# EAGLE design APRS_DP (EAGLE 9.2.2)
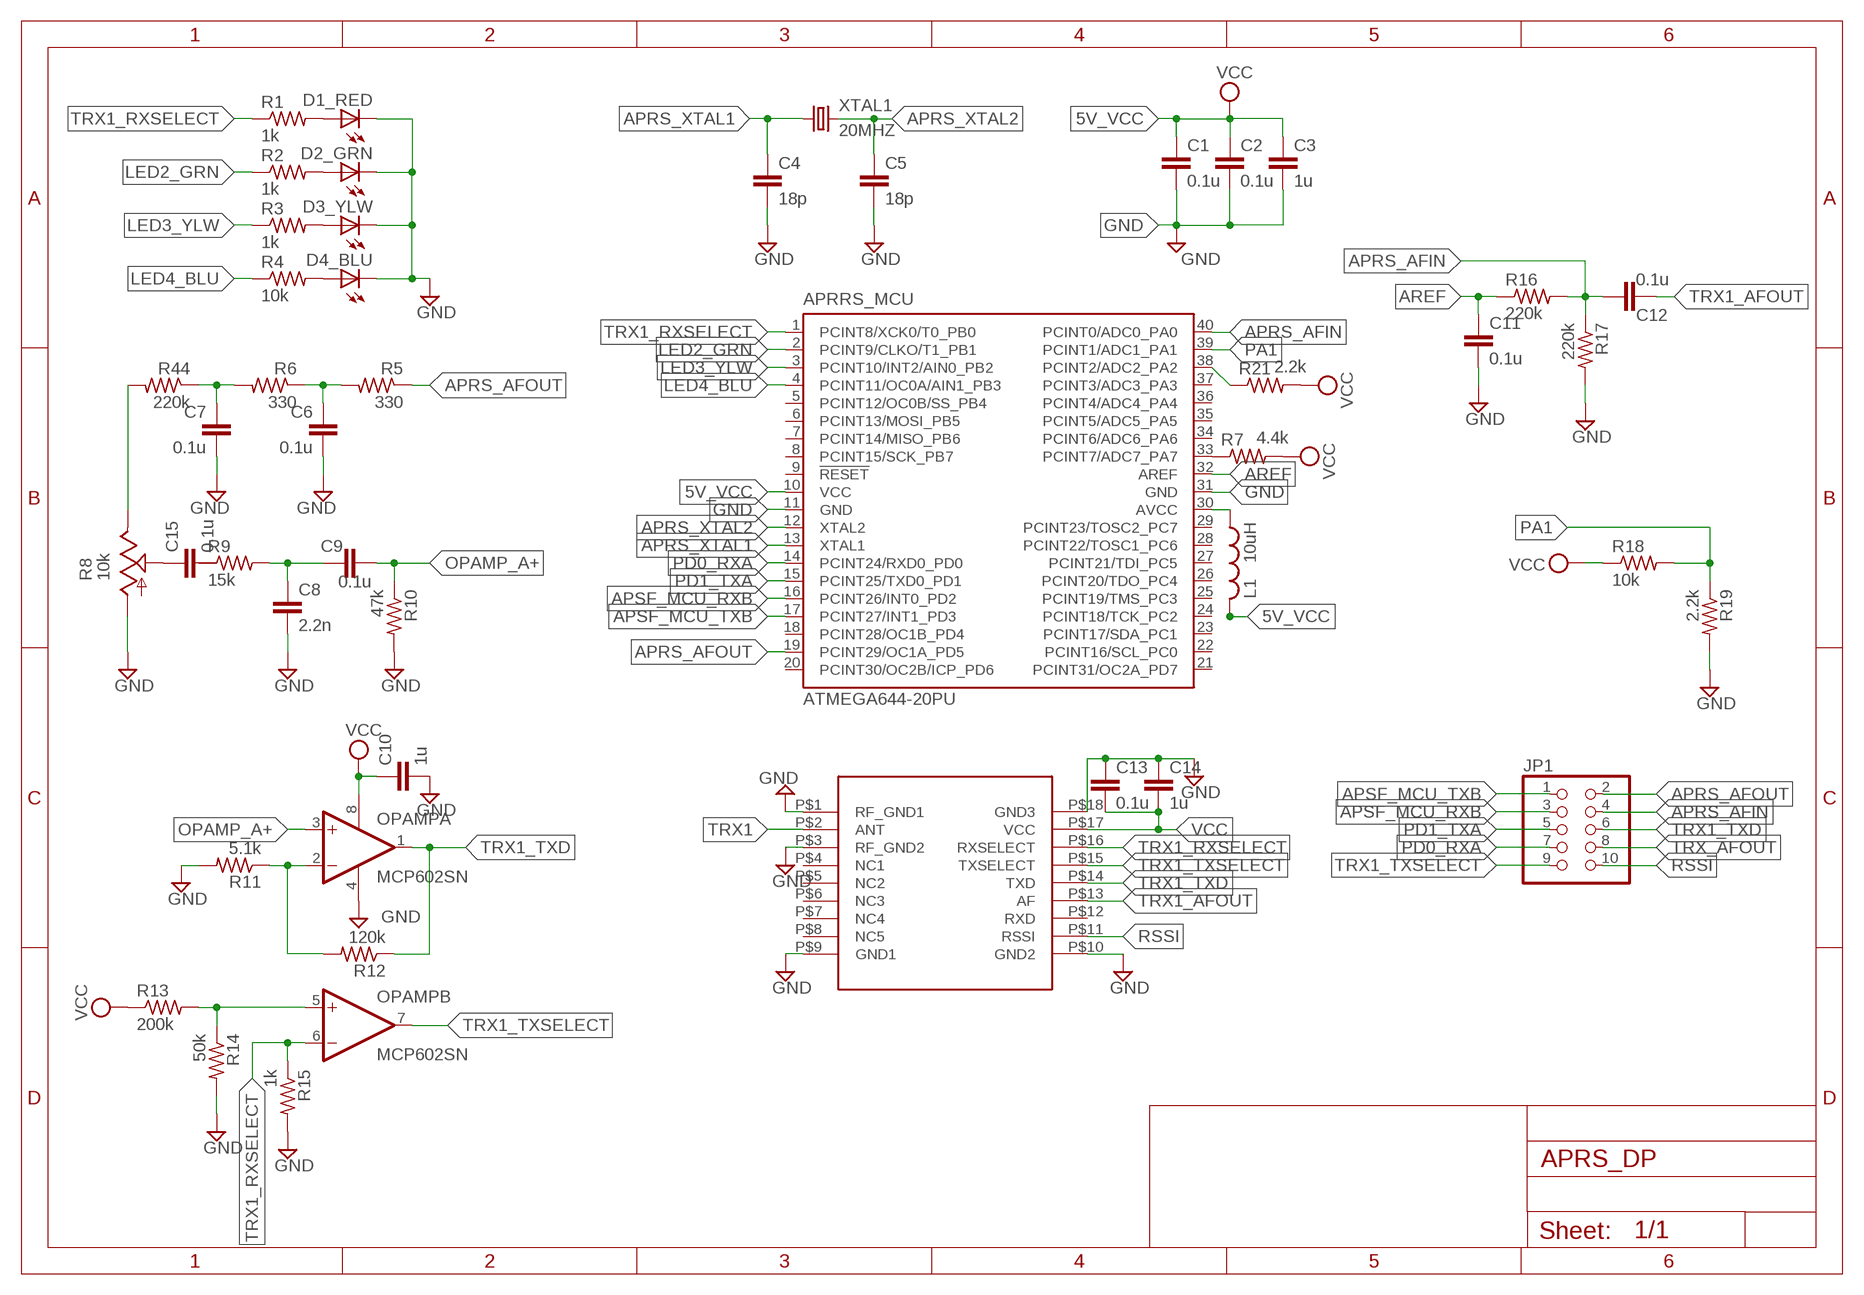
[diagram p0: schematic, sheet 1]

## Parts
APRRS_MCU  ATMEGA644-20PU  [DIL40]
BIM1H(TRX1)1  BIM1H  [BIM1H]
C1  0.1u  C  [C0805]
C2  0.1u  C  [C0805]
C3  1u  C  [C0805]
C4  18p  C  [C0805]
C5  18p  C  [C0805]
C6  0.1u  C  [C0805]
C7  0.1u  C  [C0805]
C8  2.2n  C  [C0805]
C9  0.1u  C  [C0805]
C10  1u  C  [C0805]
C11  0.1u  C  [C0805]
C12  0.1u  C  [C0805]
C13  0.1u  C  [C0805]
C14  1u  C  [C0805]
C15  0.1u  C  [C0805]
D1_RED  LEDSML0805  [SML0805]
D2_GRN  LEDSML0805  [SML0805]
D3_YLW  LEDSML0805  [SML0805]
D4_BLU  LEDSML0805  [SML0805]
JP1  PINHD-2X5  [2X05]
L1  10uH  L-USL2012C  [L2012C]
OPAMP  MCP602SN  [SO08]
R1  1k  R-US_R0805  [R0805]
R2  1k  R-US_R0805  [R0805]
R3  1k  R-US_R0805  [R0805]
R4  10k  R-US_R0805  [R0805]
R5  330  R-US_R0805  [R0805]
R6  330  R-US_R0805  [R0805]
R7  4.4k  R-US_R0805  [R0805]
R8  10k  TRIM_US-3223W  [3223W]
R9  15k  R-US_R0805  [R0805]
R10  47k  R-US_R0805  [R0805]
R11  5.1k  R-US_R0805  [R0805]
R12  120k  R-US_R0805  [R0805]
R13  200k  R-US_R0805  [R0805]
R14  50k  R-US_R0805  [R0805]
R15  1k  R-US_R0805  [R0805]
R16  220k  R-US_R0805  [R0805]
R17  220k  R-US_R0805  [R0805]
R18  10k  R-US_R0805  [R0805]
R19  2.2k  R-US_R0805  [R0805]
R21  2.2k  R-US_R0805  [R0805]
R44  220k  R-US_R0805  [R0805]
XTAL1  20MHZ  CRYSTALSM49  [SM49]

## Nets
5V_VCC: APRRS_MCU.10(VCC) C1.1 C2.1 C3.1 L1.2 ; supply symbol labelled VCC
APRS_AFIN: APRRS_MCU.40(PCINT0/ADC0_PA0) C12.1 JP1.4 R16.2 R17.1
APRS_AFOUT: APRRS_MCU.19(PCINT29/OC1A_PD5) JP1.2 R5.1
APRS_XTAL1: APRRS_MCU.13(XTAL1) C4.1 XTAL1.1
APRS_XTAL2: APRRS_MCU.12(XTAL2) C5.1 XTAL1.2
APSF_MCU_RXB: APRRS_MCU.16(PCINT26/INT0_PD2) JP1.3
APSF_MCU_TXB: APRRS_MCU.17(PCINT27/INT1_PD3) JP1.1
AREF: APRRS_MCU.32(AREF) C11.1 R16.1
GND: APRRS_MCU.11(GND) APRRS_MCU.31(GND) BIM1H(TRX1)1.P$1(RF_GND1) BIM1H(TRX1)1.P$3(RF_GND2) BIM1H(TRX1)1.P$9(GND1) BIM1H(TRX1)1.P$10(GND2) BIM1H(TRX1)1.P$18(GND3) C1.2 C2.2 C3.2 C4.2 C5.2 C6.2 C7.2 C8.2 C10.2 C11.2 C13.1 C14.1 D1_RED.C D2_GRN.C D3_YLW.C D4_BLU.C OPAMP.4(P:V-) R8.1(A) R10.2 R11.2 R14.2 R15.2 R17.2 R19.2
LED2_GRN: APRRS_MCU.2(PCINT9/CLKO/T1_PB1) R2.1
LED3_YLW: APRRS_MCU.3(PCINT10/INT2/AIN0_PB2) R3.1
LED4_BLU: APRRS_MCU.4(PCINT11/OC0A/AIN1_PB3) R4.1
N$1: APRRS_MCU.30(AVCC) L1.1
N$2: C6.1 R5.2 R6.1
N$3: D1_RED.A R1.2
N$4: D2_GRN.A R2.2
N$5: D3_YLW.A R3.2
N$6: D4_BLU.A R4.2
N$11: OPAMP.2(A:-IN) R11.1 R12.2
N$12: C15.1 R8.2(S)
N$13: APRRS_MCU.33(PCINT7/ADC7_PA7) R7.1
N$27: C7.1 R6.2 R44.1
N$28: C8.1 C9.1 R9.2
N$29: R8.3(E) R44.2
OPAMP_A+: C9.2 OPAMP.3(A:+IN) R10.1
OPAMP_B+: OPAMP.5(B:+IN) R13.2 R14.1
PA1: APRRS_MCU.39(PCINT1/ADC1_PA1) R18.2 R19.1
PA2: APRRS_MCU.38(PCINT2/ADC2_PA2) R21.1
PD0_RXA: APRRS_MCU.14(PCINT24/RXD0_PD0) JP1.7
PD1_TXA: APRRS_MCU.15(PCINT25/TXD0_PD1) JP1.5
RSSI: BIM1H(TRX1)1.P$11(RSSI) JP1.10
TRX1: BIM1H(TRX1)1.P$2(ANT)
TRX1_AFOUT: BIM1H(TRX1)1.P$13(AF) C12.2
TRX1_RXSELECT: APRRS_MCU.1(PCINT8/XCK0/T0_PB0) BIM1H(TRX1)1.P$16(RXSELECT) OPAMP.6(B:-IN) R1.1 R15.1
TRX1_TXD: BIM1H(TRX1)1.P$14(TXD) JP1.6 OPAMP.1(A:OUT) R12.1
TRX1_TXSELECT: BIM1H(TRX1)1.P$15(TXSELECT) JP1.9 OPAMP.7(B:OUT)
TRX_AFOUT: JP1.8
VCC: BIM1H(TRX1)1.P$17(VCC) C10.1 C13.2 C14.2 OPAMP.8(P:V+) R7.2 R13.1 R18.1 R21.2
Unconnected: APRRS_MCU.5(PCINT12/OC0B/SS_PB4) APRRS_MCU.6(PCINT13/MOSI_PB5) APRRS_MCU.7(PCINT14/MISO_PB6) APRRS_MCU.8(PCINT15/SCK_PB7) APRRS_MCU.9(!RESET) APRRS_MCU.18(PCINT28/OC1B_PD4) APRRS_MCU.20(PCINT30/OC2B/ICP_PD6) APRRS_MCU.21(PCINT31/OC2A_PD7) APRRS_MCU.22(PCINT16/SCL_PC0) APRRS_MCU.23(PCINT17/SDA_PC1) APRRS_MCU.24(PCINT18/TCK_PC2) APRRS_MCU.25(PCINT19/TMS_PC3) APRRS_MCU.26(PCINT20/TDO_PC4) APRRS_MCU.27(PCINT21/TDI_PC5) APRRS_MCU.28(PCINT22/TOSC1_PC6) APRRS_MCU.29(PCINT23/TOSC2_PC7) APRRS_MCU.34(PCINT6/ADC6_PA6) APRRS_MCU.35(PCINT5/ADC5_PA5) APRRS_MCU.36(PCINT4/ADC4_PA4) APRRS_MCU.37(PCINT3/ADC3_PA3) BIM1H(TRX1)1.P$4(NC1) BIM1H(TRX1)1.P$5(NC2) BIM1H(TRX1)1.P$6(NC3) BIM1H(TRX1)1.P$7(NC4) BIM1H(TRX1)1.P$8(NC5) BIM1H(TRX1)1.P$12(RXD) C15.2 R9.1

## Library data of the parts
APRRS_MCU = atmel:ATMEGA644-*PU: 8-bit Microcontroller with 64K Bytes In-System Programmable Flash Auto generated by make-symbol-device-package-bsdl.ulp Rev. 34 Source: http://www.atmel.com/dyn/resources/prod_documents/doc2593.pdf; MPN: ATMEGA644-20PU; OC_FARNELL: 1288340; OC_NEWARK: 23M5060
BIM1H(TRX1)1 = BIRDS_4_general_components_library:BIM1H
C1-C15 = eagle-ltspice:C: CAPACITOR, European symbol; SPICEMODEL: NONE; SPICEPREFIX: C
D1_RED D2_GRN D3_YLW D4_BLU = led:LED: LED OSRAM: - CHIPLED LG R971, LG N971, LY N971, LG Q971, LY Q971, LO R971, LY R971 LH N974, LH R974 LS Q976, LO Q976, LY Q976 LO Q996 - Hyper CHIPLED LW Q18S LB Q993, LB Q99A, LB R99A - SideLED LS A670, LO A670, LY A670, LG A670, LP A670 LB A673, LV A673, LT A673, LW A673 LH A674 LY A675 LS A676, LA A676, LO A676, LY A676, LW A676 LS A679, LY A679, LG A679 - Hyper Micro SIDELED® LS Y876, LA Y876, LO Y876, LY Y876 LT Y87S - SmartLED LW L88C, LW L88S LB L89C, LB L89S, LG L890 LS L89K, LO L89K, LY L89K LS L896, LA L896, LO L896, LY L896 - TOPLED LS T670, LO T670, LY T670, LG T670, LP T670 LSG T670, LSP T670, LSY T670, LOP T670, LYG T670 LG T671, LOG T671, LSG T671 LB T673, LV T673, LT T673, LW T673 LH T674 LS T676, LA T676, LO T676, LY T676, LB T676, LH T676, LSB T676, LW T676 LB T67C, LV T67C, LT T67C, LS T67K, LO T67K, LY T67K, LW E67C LS E67B, LA E67B, LO E67B, LY E67B, LB E67C, LV E67C, LT E67C LW T67C LS T679, LY T679, LG T679 LS T770, LO T770, LY T770, LG T770, LP T770 LB T773, LV T773, LT T773, LW T773 LH T774 LS E675, LA E675, LY E675, LS T675 LS T776, LA T776, LO T776, LY T776, LB T776 LHGB T686 LT T68C, LB T68C - Hyper Mini TOPLED® LB M676 - Mini TOPLED Santana® LG M470 LS M47K, LO M47K, LY M47K Source: http://www.osram.convergy.de LUXEON: - LUMILED® LXK2-PW12-R00, LXK2-PW12-S00, LXK2-PW14-U00, LXK2-PW14-V00 LXK2-PM12-R00, LXK2-PM12-S00, LXK2-PM14-U00 LXK2-PE12-Q00, LXK2-PE12-R00, LXK2-PE12-S00, LXK2-PE14-T00, LXK2-PE14-U00 LXK2-PB12-K00, LXK2-PB12-L00, LXK2-PB12-M00, LXK2-PB14-N00, LXK2-PB14-P00, LXK2-PB14-Q00 LXK2-PR12-L00, LXK2-PR12-M00, LXK2-PR14-Q00, LXK2-PR14-R00 LXK2-PD12-Q00, LXK2-PD12-R00, LXK2-PD12-S00 LXK2-PH12-R00, LXK2-PH12-S00 LXK2-PL12-P00, LXK2-PL12-Q00, LXK2-PL12-R00 Source: www.luxeon.com KINGBRIGHT: KA-3528ASYC Source: www.kingbright.com
JP1 = pinhead:PINHD-2X5: PIN HEADER
L1 = rcl:L-US: INDUCTOR, American symbol; SPICEPREFIX: L
OPAMP = linear:MCP602: Single Op Amp 2.7V to 6.0V Single Supply CMOS Source: http://ww1.microchip.com/downloads/en/DeviceDoc/21314g.pdf
R1-R7 R9-R19 R21 R44 = rcl:R-US_: RESISTOR, American symbol; SPICEPREFIX: R
R8 = pot:TRIM_US-: POTENTIOMETER
XTAL1 = crystal:CRYSTAL: CRYSTAL; OC_FARNELL: unknown; OC_NEWARK: unknown

## Board
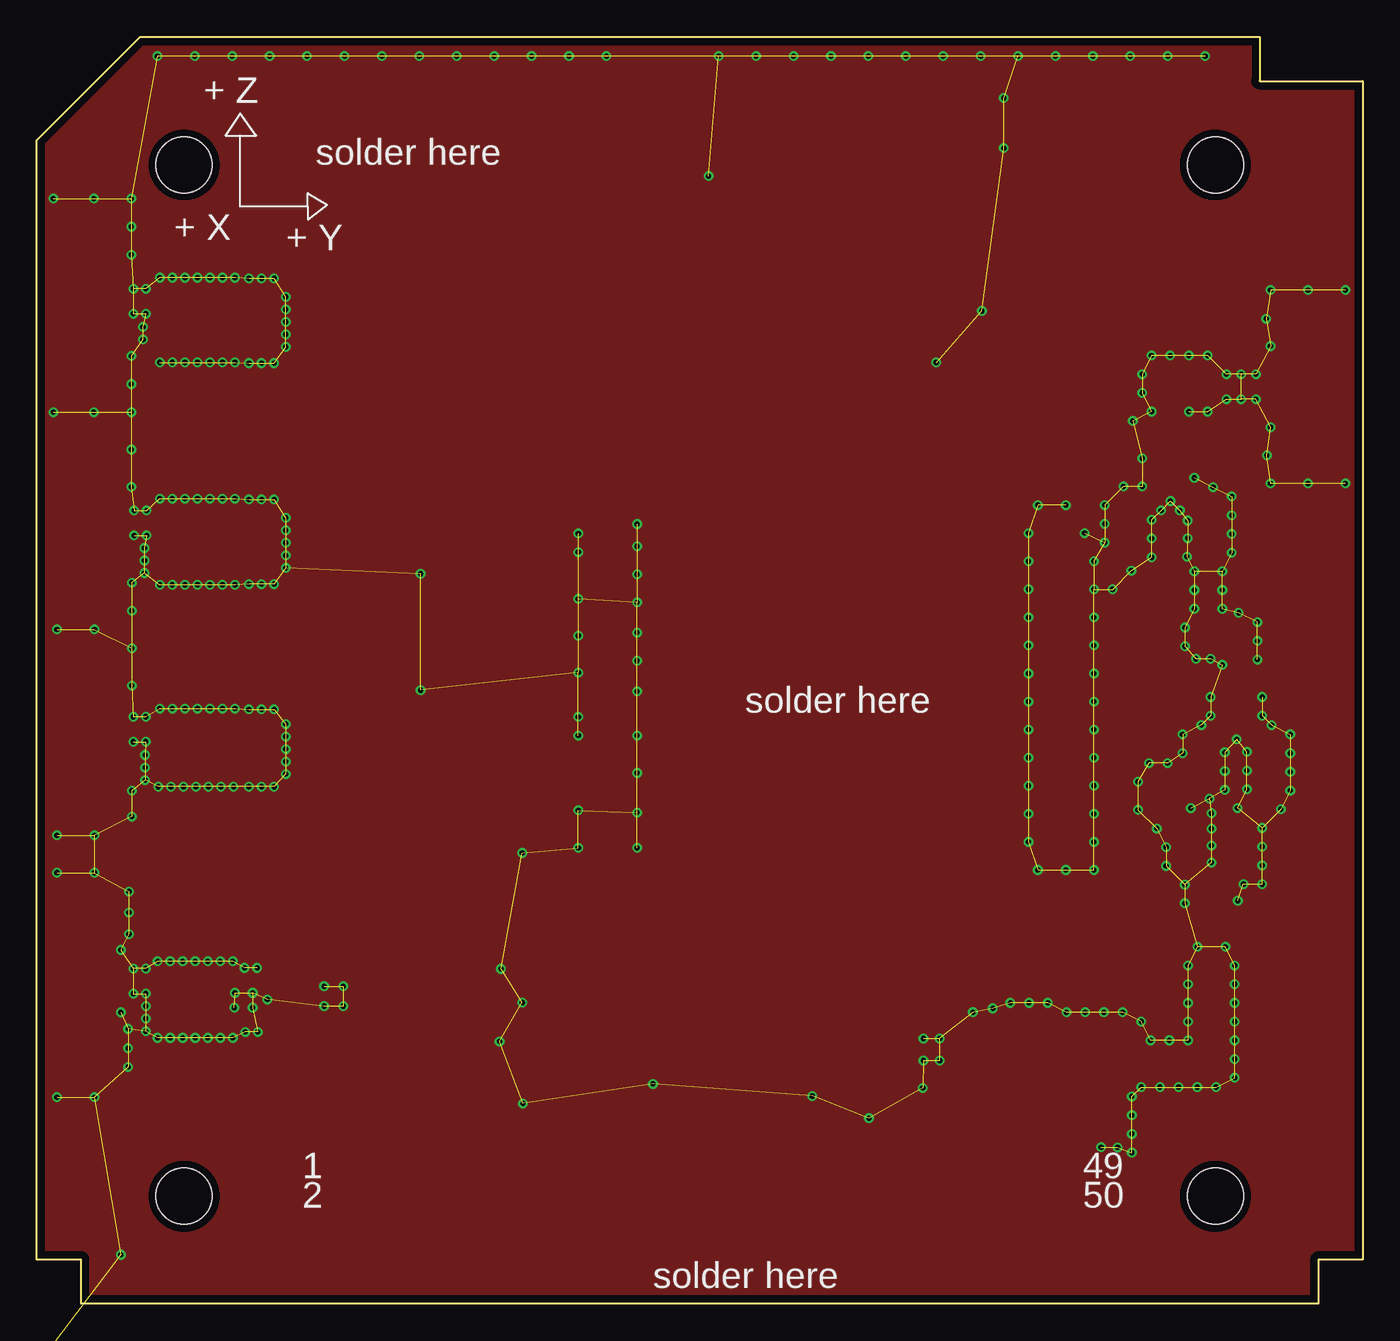
[diagram p1: board, top side]
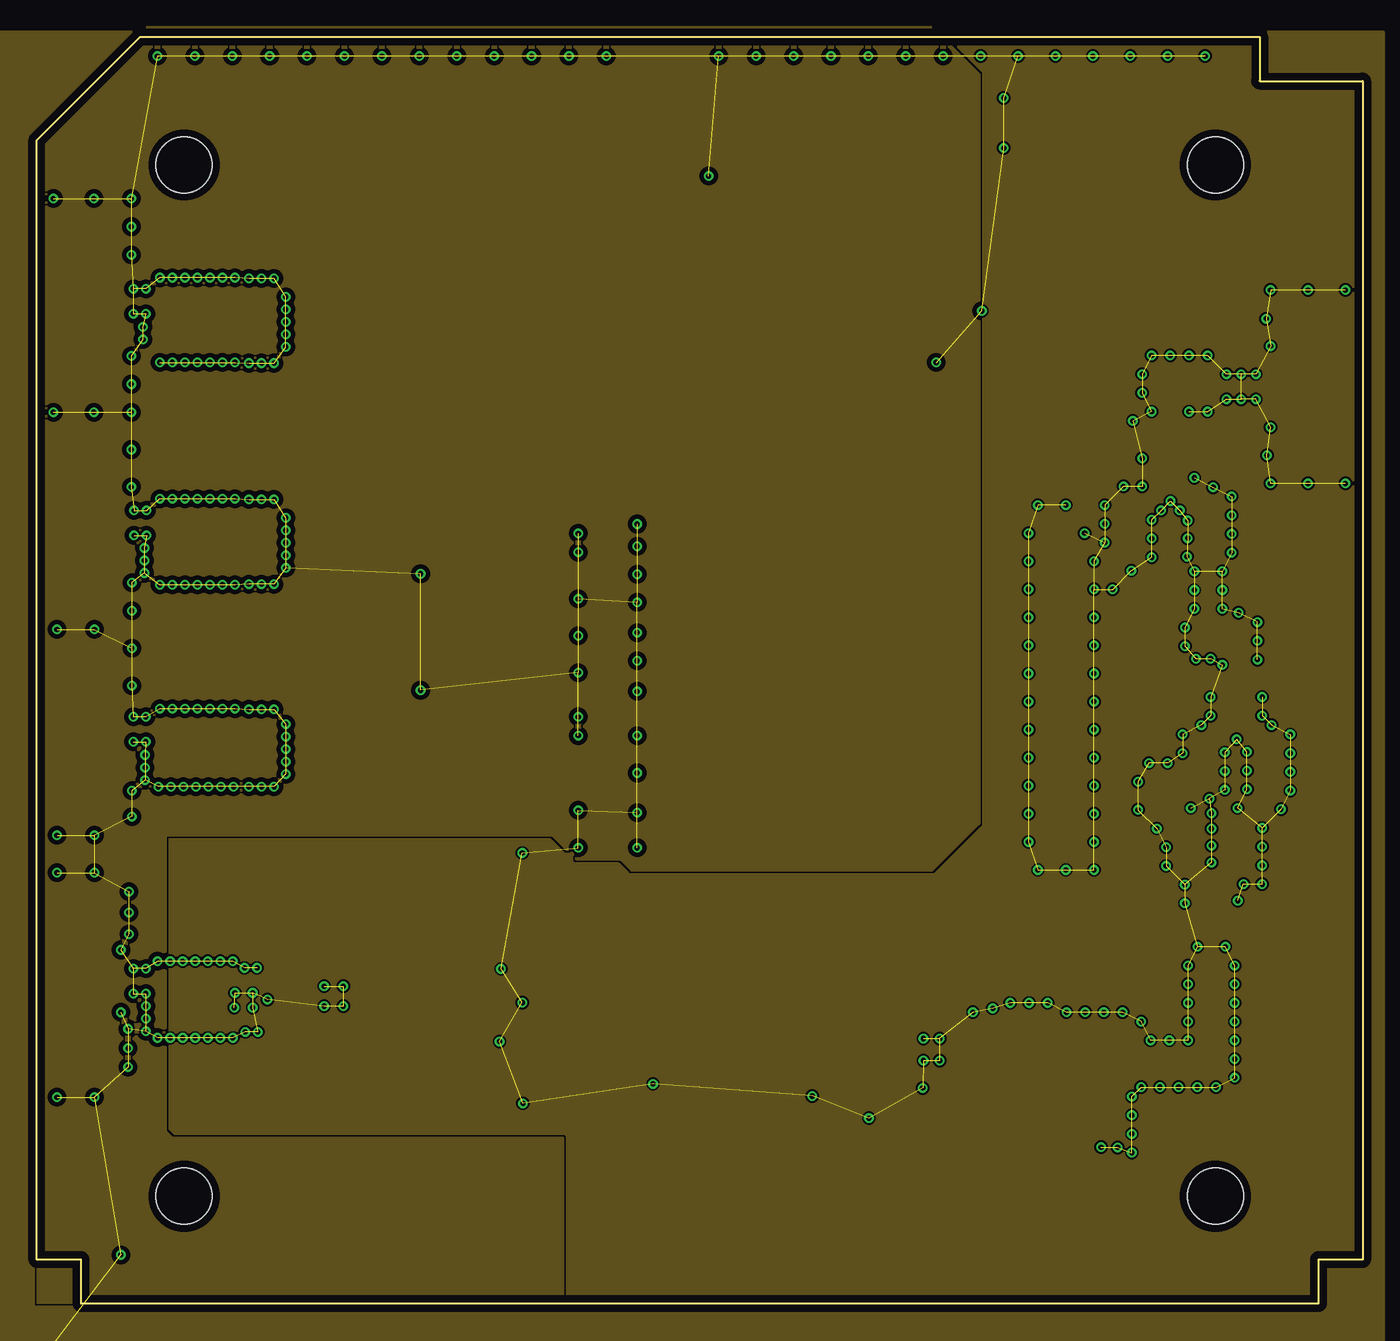
[diagram p2: board, inner layer V+]
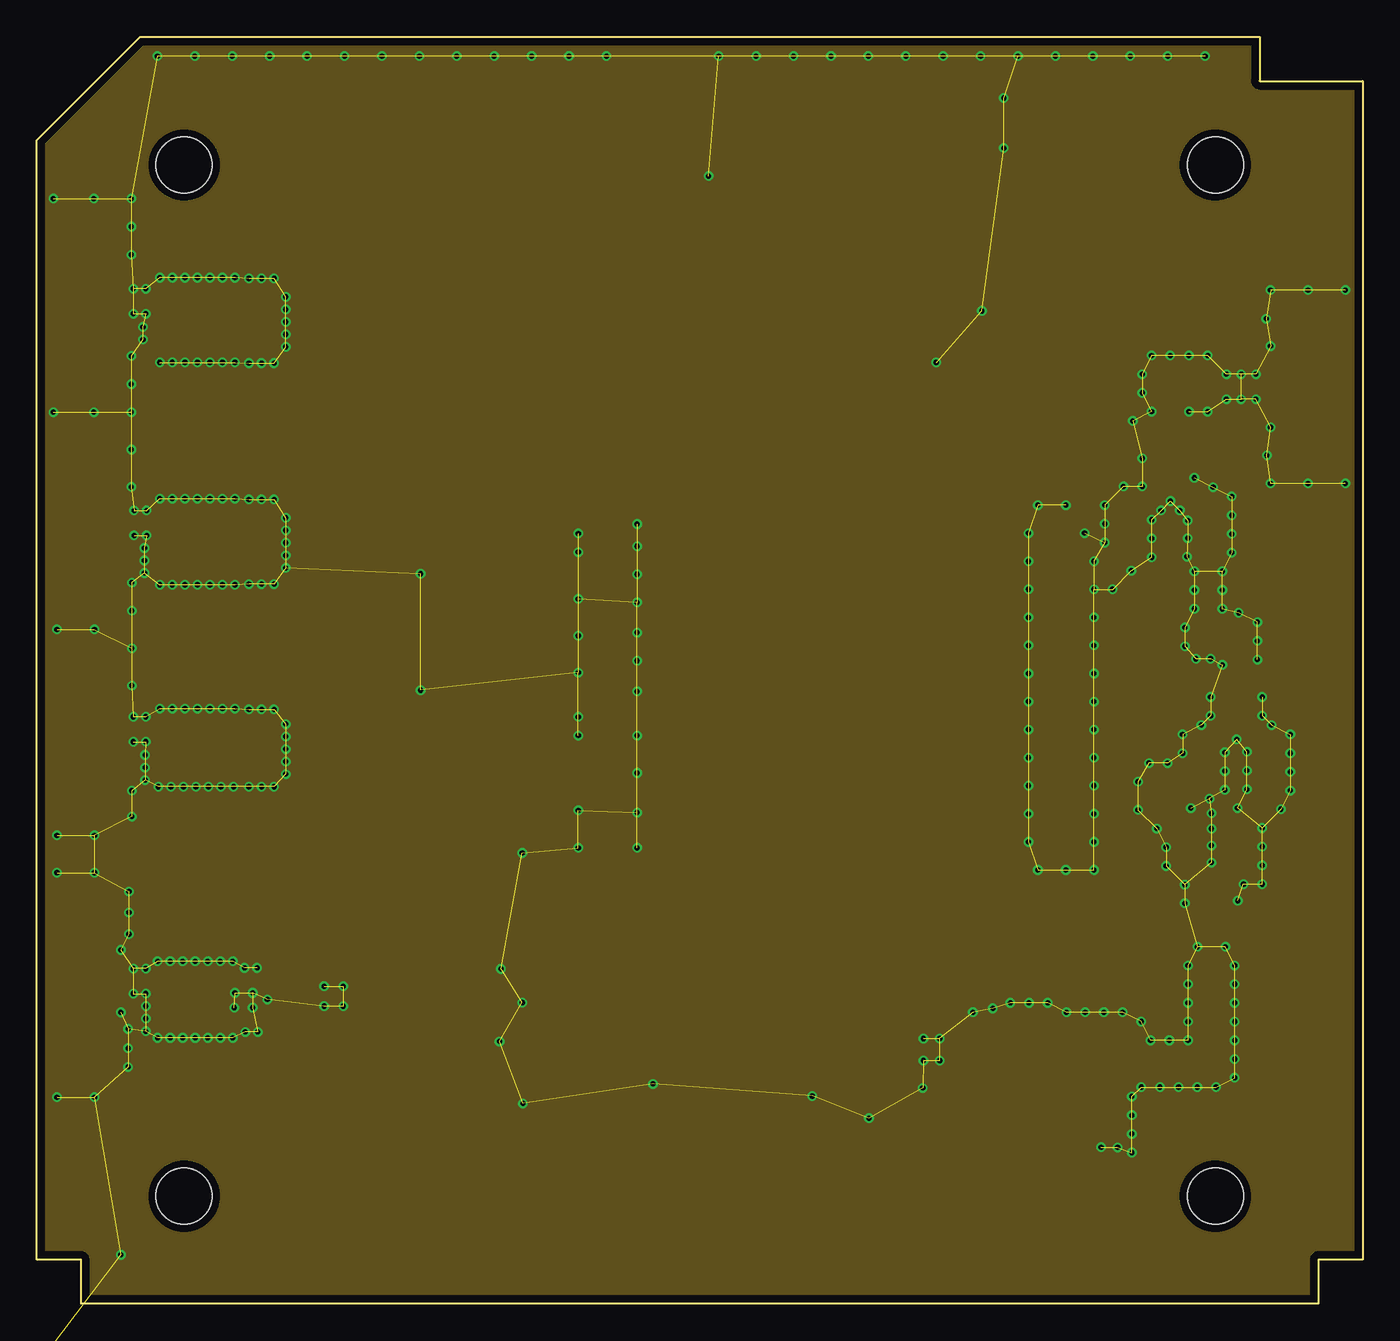
[diagram p3: board, inner layer GND]
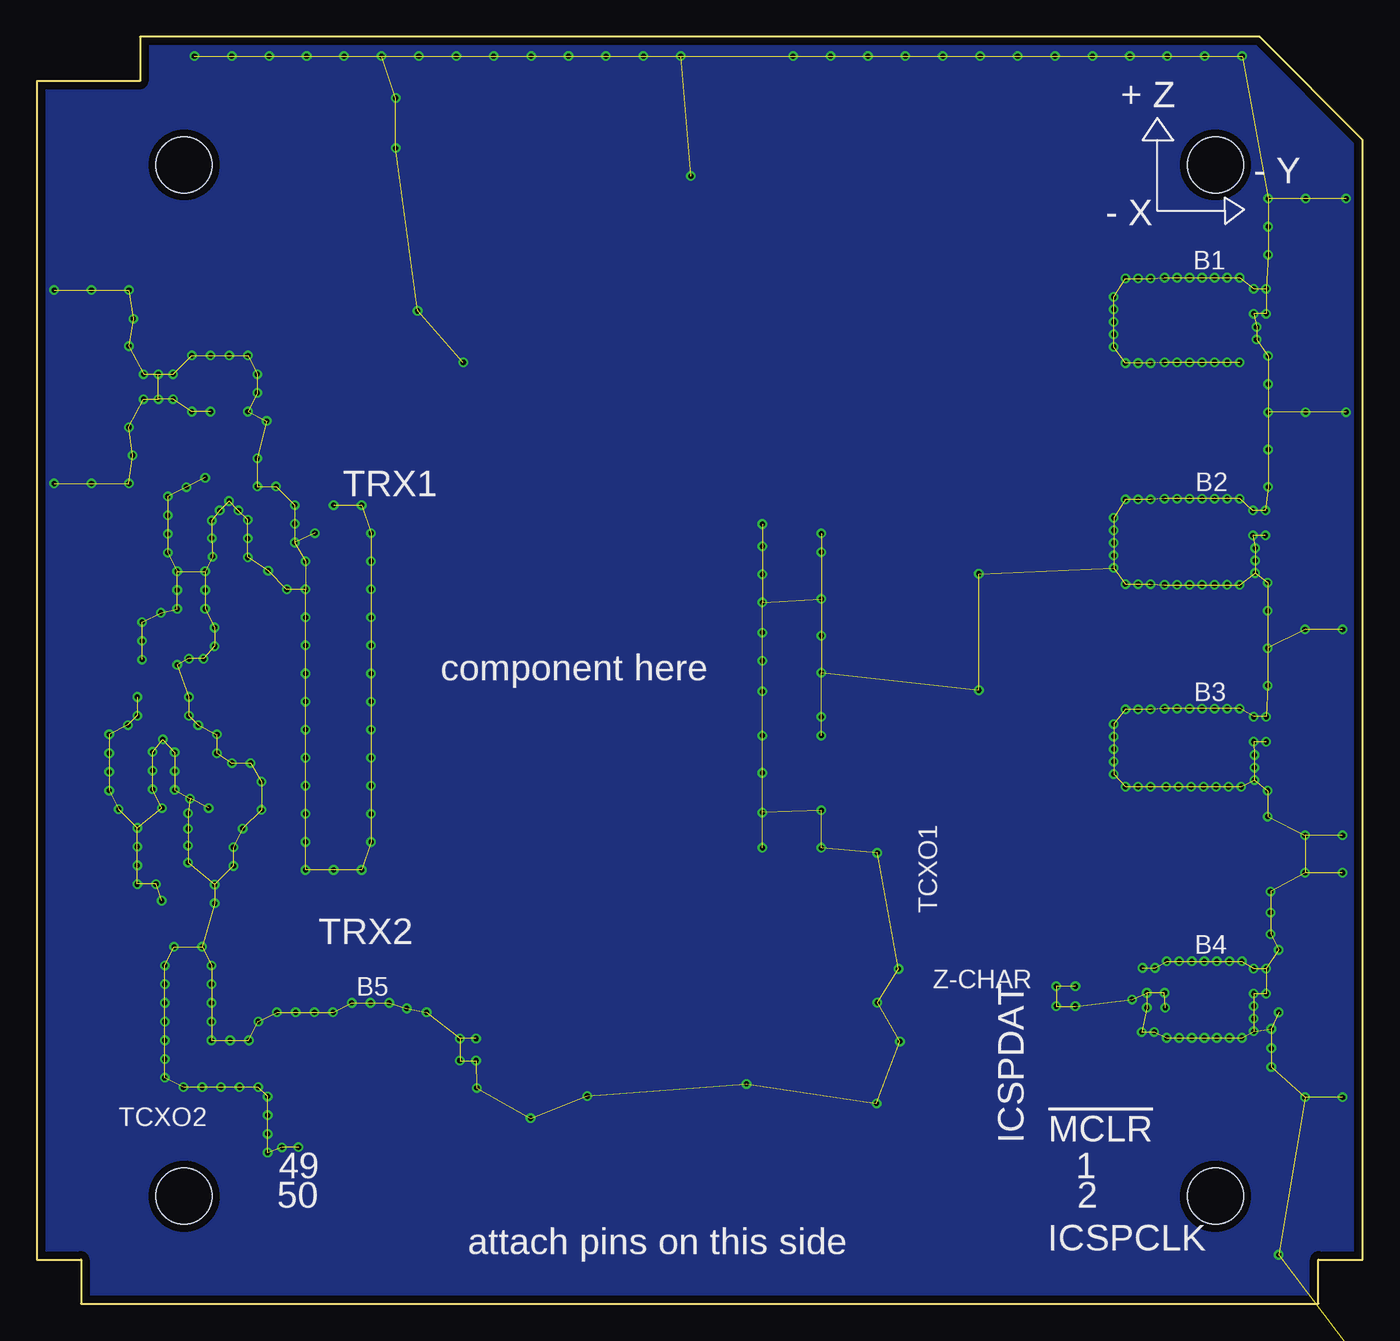
[diagram p4: board, bottom side, seen from below]

Size 90 x 86 mm. Coordinates in mm from the lower left corner, seen from the top.
Outline: 0,3 0,79 7,86 83,86 83,83 90,83 90,3 87,3 87,0 3,0 3,3 0,3
Copper layers (1+2*15+16): Top 0.018mm / dielectric 0.25mm / V+ 0.035mm / dielectric 1mm / GND 0.035mm / dielectric 0.25mm / Bottom 0.018mm
Design rules "pban_5mil-l4": minimum track width 5mil, minimum drill 0.3mm, track to track 5mil, track to pad 0.229mm, pad to pad 5mil, via to via 5mil, smd to smd 5mil, copper to edge 0.5mm, drill to drill 0.5mm, minimum pad ring 0.15mm, minimum via ring 0.15mm, stop-mask expansion 4mil, vias tented up to drill 0.35mm, thermal gap 10mil
Holes 3.8 mm at 10,7.3 80,7.3 80,77.3 10,77.3
Milling: 11 lines

### Footprints (pad centres in the part's own frame; a part is rotated, then mirrored left to right if it is on the bottom)
DIL40 = drill 0.813 long: 1 -24.13,-7.62; 2 -21.59,-7.62; 3 -19.05,-7.62; 4 -16.51,-7.62; 5 -13.97,-7.62; 6 -11.43,-7.62; 7 -8.89,-7.62; 8 -6.35,-7.62; 9 -3.81,-7.62; 10 -1.27,-7.62; 11 1.27,-7.62; 12 3.81,-7.62; 13 6.35,-7.62; 14 8.89,-7.62; 15 11.43,-7.62; 16 13.97,-7.62; 17 16.51,-7.62; 18 19.05,-7.62; 19 21.59,-7.62; 20 24.13,-7.62; 21 24.13,7.62; 22 21.59,7.62; 23 19.05,7.62; 24 16.51,7.62; 25 13.97,7.62; 26 11.43,7.62; 27 8.89,7.62; 28 6.35,7.62; 29 3.81,7.62; 30 1.27,7.62; 31 -1.27,7.62; 32 -3.81,7.62; 33 -6.35,7.62; 34 -8.89,7.62; 35 -11.43,7.62; 36 -13.97,7.62; 37 -16.51,7.62; 38 -19.05,7.62; 39 -21.59,7.62; 40 -24.13,7.62
BIM1H = drill 1.2 pad 2 square: P$1 1.27,21.59; P$2 1.27,19.05; P$3 1.27,16.51; P$4 1.27,13.97; P$5 1.27,11.43; P$6 1.27,8.89; P$7 1.27,6.35; P$8 1.27,3.81; P$9 1.27,1.27; P$10 31.75,1.27; P$11 31.75,3.81; P$12 31.75,6.35; P$13 31.75,8.89; P$14 31.75,11.43; P$15 31.75,13.97; P$16 31.75,16.51; P$17 31.75,19.05; P$18 31.75,21.59
C0805 = smd 1.3 x 1.5: 1 -0.95,0; 2 0.95,0
SML0805 = smd 1.2 x 1.2: A 1.05,0; C -1.05,0
2X05 = drill 1.016 octagon: 1 -5.08,-1.27; 2 -5.08,1.27; 3 -2.54,-1.27; 4 -2.54,1.27; 5 0,-1.27; 6 0,1.27; 7 2.54,-1.27; 8 2.54,1.27; 9 5.08,-1.27; 10 5.08,1.27
L2012C = smd 1 x 1: 1 -1,0; 2 1,0
SO08 = smd 0.6 x 2.2: 1 -1.905,-2.6; 2 -0.635,-2.6; 3 0.635,-2.6; 4 1.905,-2.6; 5 1.905,2.6; 6 0.635,2.6; 7 -0.635,2.6; 8 -1.905,2.6
R0805 = smd 1.3 x 1.5: 1 -0.95,0; 2 0.95,0
3223W = smd 0.9 x 1.6: 1 -1.4,-1.215; 3 1.4,-1.215 | smd 1.3 x 1.3: 2 0,1.215
SM49 = smd 5.08 x 1.778: 1 -4.826,0; 2 4.826,0

### Placement (x,y rotation side)
APRRS_MCU  -134.55,-191.35 0 top  (outside the outline)
BIM1H(TRX1)1  -162.75,-390.15 0 top  (outside the outline)
C1  -161.75,-209.65 0 top  (outside the outline)
C2  -161.75,-215.8 0 top  (outside the outline)
C3  -161.75,-221.95 0 top  (outside the outline)
C4  -161.75,-237.2 0 top  (outside the outline)
C5  -157.55,-237.2 0 top  (outside the outline)
C6  -157.05,-318.1 0 top  (outside the outline)
C7  -152.55,-318.1 0 top  (outside the outline)
C8  -161.75,-318.1 0 top  (outside the outline)
C9  -161.75,-324.25 0 top  (outside the outline)
C10  -156.6,-348.55 0 top  (outside the outline)
C11  -156.6,-293.1 0 top  (outside the outline)
C12  -161.75,-364 0 top  (outside the outline)
C13  -161.75,-394.3 0 top  (outside the outline)
C14  -161.75,-400.45 0 top  (outside the outline)
C15  -161.75,-433.6 0 top  (outside the outline)
D1_RED  -153.45,-249.25 0 top  (outside the outline)
D2_GRN  -161.75,-255.4 0 top  (outside the outline)
D3_YLW  -157.95,-255.4 0 top  (outside the outline)
D4_BLU  -154.15,-255.4 0 top  (outside the outline)
JP1  -156.9,-427.85 0 top  (outside the outline)
L1  -161.35,-203.5 0 top  (outside the outline)
OPAMP  -159.3,-335.45 0 top  (outside the outline)
R1  -161.75,-249.5 0 top  (outside the outline)
R2  -157.6,-249.5 0 top  (outside the outline)
R3  -161.75,-243.35 0 top  (outside the outline)
R4  -156.6,-243.35 0 top  (outside the outline)
R5  -151.4,-303.9 0 top  (outside the outline)
R6  -161.75,-311.95 0 top  (outside the outline)
R7  -161.75,-439.75 0 top  (outside the outline)
R8  -161.35,-304.85 0 top  (outside the outline)
R9  -156.6,-311.95 0 top  (outside the outline)
R10  -151.45,-311.95 0 top  (outside the outline)
R11  -156,-342.4 0 top  (outside the outline)
R12  -152.85,-330.4 0 top  (outside the outline)
R13  -161.75,-342.4 0 top  (outside the outline)
R14  -150.75,-342.4 0 top  (outside the outline)
R15  -161.75,-348.55 0 top  (outside the outline)
R16  -156.25,-279.5 0 top  (outside the outline)
R17  -161.75,-286.95 0 top  (outside the outline)
R18  -161.75,-293.1 0 top  (outside the outline)
R19  -156,-286.95 0 top  (outside the outline)
R21  -161.75,-445.9 0 top  (outside the outline)
R44  -157.15,-303.9 0 top  (outside the outline)
XTAL1  -156.3,-229.5 0 top  (outside the outline)

### Tracks (layer width: path | path; a pad name or v marks a point on that pad's centre or on a via)
5V_VCC  (4 unrouted)
APRS_AFIN  (4 unrouted)
APRS_AFOUT  (2 unrouted)
APRS_XTAL1  (2 unrouted)
APRS_XTAL2  (2 unrouted)
APSF_MCU_RXB  (1 unrouted)
APSF_MCU_TXB  (1 unrouted)
AREF  (2 unrouted)
GND  (via drill 0.35)  (433 unrouted)
  other vias: 19.5,21.55 20.8,21.55 20.8,20.2 19.5,20.2 33,13.6 32.95,30.6 6.55,21.05 6.55,22.75 26.05,41.65 80.75,61.4 81.75,61.4 82.75,61.4 80.75,63.1 81.75,63.1 82.75,63.1 52.63,14.1 5.7,3.32 6.45,33.07 3.91,31.8 1.37,31.8 6.45,41.96 6.45,44.5 3.91,45.77 1.37,45.77 7.4,21.05 7.4,22.75 8.2,23.25 9.05,23.25 9.9,23.25 10.75,23.25 11.6,23.25 12.45,23.25 13.3,23.25 7.4,20.2 7.4,19.35 7.4,18.5 8.2,18.05 14.1,22.8 14.95,22.8 13.45,21.1 13.4,20.1 14.65,20.1 14.65,21.1 15.65,20.65 5.7,24.02 6.25,25.09 6.25,26.56 6.25,27.98 5.7,19.78 6.2,18.66 6.2,17.34 6.2,16.07 9.05,18.05 9.9,18.05 10.75,18.05 11.6,18.05 12.45,18.05 13.3,18.05 14.15,18.45 15,18.45 9.1,35.1 9.95,35.1 10.8,35.1 11.65,35.1 12.5,35.1 13.35,35.1 8.25,35.1 9.2,40.4 10.05,40.4 10.9,40.4 11.75,40.4 12.6,40.4 13.45,40.4 6.55,38.15 6.55,39.85 7.4,38.15 7.4,39.85 8.35,40.4 6.6,52.15 6.6,53.85 7.45,52.15 7.45,53.85 6.55,67.2 6.55,68.9 7.4,67.2 7.4,68.9 1.37,29.26 3.91,29.26 1.37,14.02 3.91,14.02 1.12,60.52 3.87,60.52 9.2,69.65 10.05,69.65 10.9,69.65 11.75,69.65 12.6,69.65 13.45,69.65 14.4,69.6 15.25,69.6 16.1,69.6 16.9,64.95 16.9,65.8 16.9,66.65 16.9,67.5 16.9,68.35 8.35,69.65 9.2,63.9 10.05,63.9 10.9,63.9 11.75,63.9 12.6,63.9 13.45,63.9 14.4,63.85 15.25,63.85 16.1,63.85 7.2,66.3 7.2,65.45 8.35,63.9 9.2,54.65 10.05,54.65 10.9,54.65 11.75,54.65 12.6,54.65 13.45,54.65 9.2,48.8 10.05,48.8 10.9,48.8 11.75,48.8 12.6,48.8 13.45,48.8 7.3,51.3 7.3,50.45 7.3,49.6 8.35,48.8 14.4,54.6 15.25,54.6 16.1,54.6 16.9,49.95 16.9,50.8 16.9,51.65 16.9,52.5 16.9,53.35 14.4,48.85 15.25,48.85 16.1,48.85 8.35,54.65 16.9,35.95 16.9,36.8 16.9,37.65 16.9,38.5 16.9,39.35 14.4,40.35 15.25,40.35 16.1,40.35 14.4,35.1 15.25,35.1 16.1,35.1 7.35,37.25 7.35,36.4 7.35,35.55 79.48,64.37 78.21,64.37 76.94,64.37 75.67,64.37 75.03,63.1 75.03,61.83 75.67,60.56 74.4,59.92 79.48,60.56 78.21,60.56 75.03,57.38 75.03,55.48 73.77,55.48 71.76,50.4 71.76,48.49 72.5,54.21 72.5,52.94 72.5,51.67 73.03,48.49 74.3,49.77 76.95,54.48 76.32,53.85 75.69,53.22 75.69,51.95 75.69,50.67 77.59,53.85 78.12,53.16 78.12,51.97 78.07,50.72 78.57,49.72 78.57,48.45 78.57,47.17 80.47,49.72 80.47,48.45 80.47,47.17 81.11,50.98 81.11,52.26 81.11,53.52 81.11,54.8 79.84,55.43 78.57,56.06 77.94,45.91 77.94,44.63 80.47,43.37 78.68,43.78 79.68,43.78 79.68,41.19 79.68,39.91 79.05,39.28 77.78,38.65 77.78,37.38 81.58,46.9 82.86,46.27 82.86,44.99 82.86,43.73 36.75,30.95 36.75,33.49 36.75,38.57 36.75,39.84 36.75,42.84 36.75,45.34 36.75,47.84 40.75,30.95 40.75,33.34 40.75,36.03 40.75,38.57 40.75,41.57 40.75,43.65 56.48,12.6 83.18,41.19 83.18,39.91 83.81,39.28 85.08,38.65 85.08,37.38 81.44,38.31 80.64,37.42 82.14,37.46 80.64,36.16 80.64,34.88 82.14,36.19 85.08,36.1 85.08,34.84 84.45,33.56 83.18,32.3 83.18,31.02 83.18,29.75 83.18,28.48 81.91,28.48 81.53,27.36 82.14,34.92 81.51,33.65 79.61,34.28 78.33,33.65 79.73,29.95 79.73,31.1 79.73,32.25 79.73,33.3 76.76,36.7 75.49,36.7 74.75,35.44 74.75,33.53 76.03,32.26 76.66,30.99 76.66,29.72 77.93,28.45 77.93,27.18 78.78,24.23 80.68,24.23 81.31,22.96 81.31,21.69 78.14,22.96 78.14,21.69 78.14,20.42 81.31,20.42 81.31,19.15 81.31,17.88 78.14,19.15 78.14,17.88 76.88,17.88 75.61,17.88 81.31,16.61 81.31,15.34 80.05,14.71 78.78,14.71 77.5,14.71 76.23,14.71 74.97,14.71 74.33,14.07 74.33,12.8 74.33,11.53 74.33,10.26 73.36,10.61 72.24,10.62 74.97,19.15 73.7,19.79 72.43,19.79 71.16,19.79 69.89,19.79 68.62,20.42 67.35,20.42 66.08,20.42 63.54,19.79 64.89,20.05 1.12,75.02 3.87,75.02 40.75,45.55 40.75,47.61 40.75,49.52 40.75,51.42 36.75,51.02 36.75,52.28 40.75,52.92 71.76,46.59 71.76,44.69 71.76,42.78 71.76,40.88 71.76,38.97 71.76,37.06 71.76,35.16 71.76,33.26 71.76,31.35 71.76,29.45 69.86,29.45 67.95,29.45 67.31,31.35 67.31,33.26 67.31,35.16 67.31,37.06 67.31,38.97 67.31,40.88 67.31,42.78 67.31,44.69 67.31,46.59 67.31,48.49 67.31,50.4 67.31,52.3 67.95,54.21 69.86,54.21 71.12,52.3 6.45,47.04 6.41,60.52 6.41,57.98 6.41,55.44 6.45,48.95 6.41,62.42 6.41,64.33 6.41,75.02 6.41,73.11 6.41,71.21 88.83,68.81 86.29,68.81 83.75,68.81 83.45,66.86 83.75,65 83.75,59.49 83.5,57.59 83.75,55.69 86.29,55.69 88.83,55.69 65.64,78.45 65.64,81.85 58.98,84.69 56.45,84.69 53.91,84.69 51.37,84.69 48.83,84.69 46.28,84.69 38.66,84.69 36.12,84.69 33.59,84.69 31.05,84.69 28.5,84.69 25.96,84.69 23.43,84.69 20.89,84.69 18.34,84.69 15.8,84.69 13.27,84.69 10.72,84.69 8.19,84.69 61.52,84.69 64.06,84.69 66.61,84.69 69.14,84.69 71.69,84.69 74.22,84.69 76.77,84.69 79.31,84.69 32.95,20.44 31.51,22.73 31.41,17.8 41.83,14.92 60.13,14.64 60.19,16.5 60.19,18 61.28,18 61.28,16.5 45.6,76.55 26.05,49.55 64.15,67.4 61.05,63.9 6.45,34.82
  pour Top (isolate 0.305, rank 4, no thermals): -2,87.6 92.4,87.6 92.4,-1.6 -2,-1.6
  pour GND (rank 5, no thermals): -1.5,85.6 91.1,85.6 91.1,-3.6 -1.5,-3.6
  pour Bottom (isolate 0.305, rank 4, no thermals): -0.5,86.3 91.75,86.3 91.75,-0.4 -0.5,-0.4
LED2_GRN  (1 unrouted)
LED3_YLW  (1 unrouted)
LED4_BLU  (1 unrouted)
N$1  (1 unrouted)
N$2  (2 unrouted)
N$3  (1 unrouted)
N$4  (1 unrouted)
N$5  (1 unrouted)
N$6  (1 unrouted)
N$11  (2 unrouted)
N$12  (1 unrouted)
N$13  (1 unrouted)
N$27  (2 unrouted)
N$28  (2 unrouted)
N$29  (1 unrouted)
OPAMP_A+  (2 unrouted)
OPAMP_B+  (2 unrouted)
PA1  (2 unrouted)
PA2  (1 unrouted)
PD0_RXA  (1 unrouted)
PD1_TXA  (1 unrouted)
RSSI  (1 unrouted)
TRX1_AFOUT  (1 unrouted)
TRX1_RXSELECT  (4 unrouted)
TRX1_TXD  (3 unrouted)
TRX1_TXSELECT  (2 unrouted)
V+
  pour V+ (rank 5, no thermals): -3.35,86.3 91.4,86.3 91.4,-2.9 -3.35,-2.9
VCC  (8 unrouted)
  pour V+ (isolate 0.305, rank 2): 35.7,11.25 35.7,0.05 0.15,0.05 0.1,0 0.1,79.3 7.45,86.65 60.75,86.65 63.95,83.45 63.95,32.6 60.75,29.4 40.4,29.4 39.65,30.15 36.65,30.15 35,31.8 8.75,31.8 8.7,31.85 8.7,11.75 8.85,11.6 9.2,11.25

### Text on the board
tNames: + Z | solder here | + X | + Y | solder here | 1 | 49 | 2 | 50 | solder here
bNames: + Z | - Y | - X | B1 | B2 | TRX1 | component here | B3 | TCXO1 | B4 | TRX2 | Z-CHAR | B5 | TCXO2 | !MCLR! | ICSPDAT | 1 | 49 | 2 | 50 | ICSPCLK | attach pins on this side